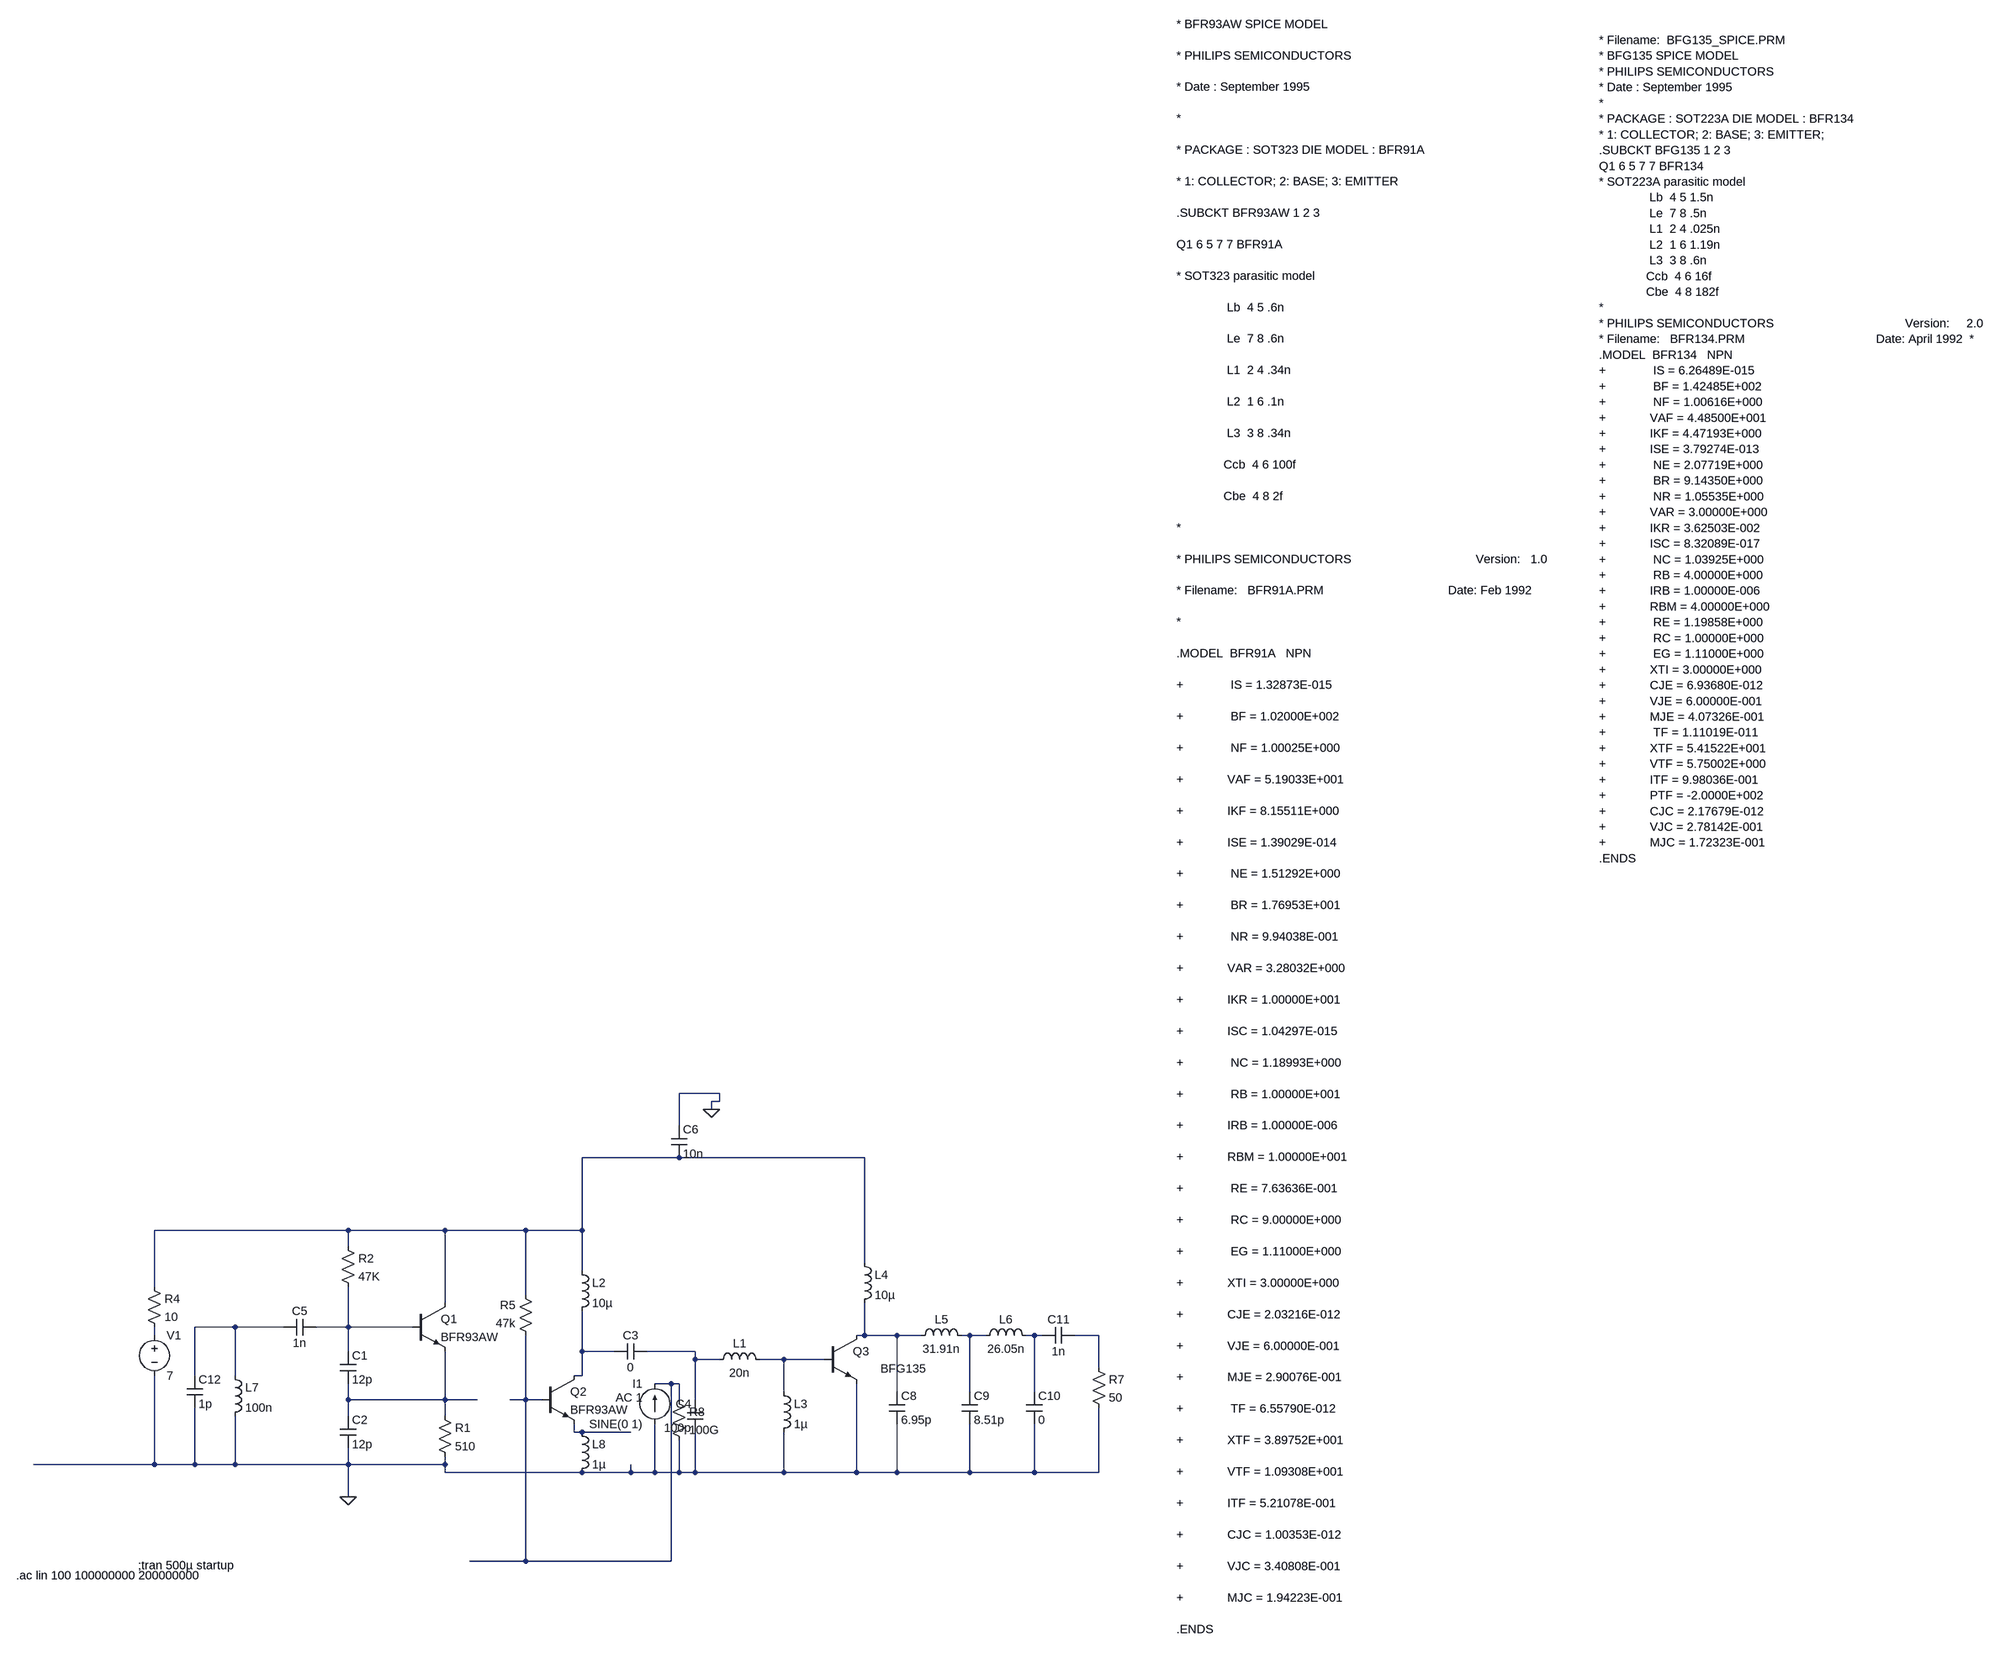
[diagram p0: schematic tx1.asc]
tx1.asc, the LTspice schematic file:
Version 4
SHEET 1 4656 820
WIRE 976 -960 896 -960
WIRE 976 -944 976 -960
WIRE 976 -944 960 -944
WIRE 960 -928 960 -944
WIRE 896 -896 896 -960
WIRE 896 -832 704 -832
WIRE 1264 -832 896 -832
WIRE 240 -688 -144 -688
WIRE 432 -688 240 -688
WIRE 592 -688 432 -688
WIRE 704 -688 704 -832
WIRE 704 -688 592 -688
WIRE 240 -656 240 -688
WIRE 1264 -624 1264 -832
WIRE 704 -608 704 -688
WIRE -144 -576 -144 -688
WIRE 592 -560 592 -688
WIRE 432 -544 432 -688
WIRE 16 -496 -64 -496
WIRE 112 -496 16 -496
WIRE 240 -496 240 -576
WIRE 240 -496 176 -496
WIRE 368 -496 240 -496
WIRE -144 -480 -144 -496
WIRE 1264 -480 1264 -544
WIRE 1264 -480 1248 -480
WIRE 1328 -480 1264 -480
WIRE 1376 -480 1328 -480
WIRE 1472 -480 1456 -480
WIRE 1504 -480 1472 -480
WIRE 1600 -480 1584 -480
WIRE 1616 -480 1600 -480
WIRE 1728 -480 1680 -480
WIRE 240 -448 240 -496
WIRE 704 -448 704 -528
WIRE 768 -448 704 -448
WIRE 928 -448 832 -448
WIRE 928 -432 928 -448
WIRE 976 -432 928 -432
WIRE 1104 -432 1056 -432
WIRE 1184 -432 1104 -432
WIRE 1728 -416 1728 -480
WIRE -64 -400 -64 -496
WIRE 16 -400 16 -496
WIRE 704 -400 704 -448
WIRE 704 -400 688 -400
WIRE 880 -384 848 -384
WIRE 896 -384 880 -384
WIRE 1104 -368 1104 -432
WIRE 1328 -368 1328 -480
WIRE 1472 -368 1472 -480
WIRE 1600 -368 1600 -480
WIRE 240 -352 240 -384
WIRE 432 -352 432 -448
WIRE 432 -352 240 -352
WIRE 496 -352 432 -352
WIRE 592 -352 592 -480
WIRE 592 -352 560 -352
WIRE 624 -352 592 -352
WIRE 896 -352 896 -384
WIRE 928 -352 928 -432
WIRE 240 -320 240 -352
WIRE 432 -320 432 -352
WIRE 688 -288 688 -304
WIRE 704 -288 688 -288
WIRE 800 -288 704 -288
WIRE -144 -224 -144 -400
WIRE -144 -224 -384 -224
WIRE -64 -224 -64 -336
WIRE -64 -224 -144 -224
WIRE 16 -224 16 -320
WIRE 16 -224 -64 -224
WIRE 240 -224 240 -256
WIRE 240 -224 16 -224
WIRE 432 -224 432 -240
WIRE 432 -224 240 -224
WIRE 432 -208 432 -224
WIRE 704 -208 432 -208
WIRE 800 -208 800 -224
WIRE 800 -208 704 -208
WIRE 848 -208 848 -304
WIRE 848 -208 800 -208
WIRE 896 -208 896 -272
WIRE 896 -208 848 -208
WIRE 928 -208 928 -288
WIRE 928 -208 896 -208
WIRE 1104 -208 1104 -288
WIRE 1104 -208 928 -208
WIRE 1248 -208 1248 -384
WIRE 1248 -208 1104 -208
WIRE 1328 -208 1328 -304
WIRE 1328 -208 1248 -208
WIRE 1472 -208 1472 -304
WIRE 1472 -208 1328 -208
WIRE 1600 -208 1600 -304
WIRE 1600 -208 1472 -208
WIRE 1728 -208 1728 -336
WIRE 1728 -208 1600 -208
WIRE 240 -160 240 -224
WIRE 592 -32 592 -352
WIRE 592 -32 480 -32
WIRE 880 -32 880 -384
WIRE 880 -32 592 -32
FLAG 240 -160 0
FLAG 960 -928 0
SYMBOL npn 368 -544 R0
SYMATTR InstName Q1
SYMATTR Value BFR93AW
SYMATTR Prefix X
SYMBOL res 416 -336 R0
SYMATTR InstName R1
SYMATTR Value 510
SYMBOL res 224 -672 R0
SYMATTR InstName R2
SYMATTR Value 47K
SYMBOL cap 224 -448 R0
SYMATTR InstName C1
SYMATTR Value 12p
SYMBOL cap 224 -320 R0
SYMATTR InstName C2
SYMATTR Value 12p
SYMBOL voltage -144 -496 R0
WINDOW 123 0 0 Left 2
WINDOW 39 0 0 Left 2
SYMATTR InstName V1
SYMATTR Value 7
SYMBOL res -160 -592 R0
SYMATTR InstName R4
SYMATTR Value 10
SYMBOL npn 624 -400 R0
SYMATTR InstName Q2
SYMATTR Value BFR93AW
SYMATTR Prefix X
SYMBOL res 608 -464 R180
WINDOW 0 36 76 Left 2
WINDOW 3 36 40 Left 2
SYMATTR InstName R5
SYMATTR Value 47k
SYMBOL ind 688 -624 R0
SYMATTR InstName L2
SYMATTR Value 10µ
SYMBOL npn 1184 -480 R0
WINDOW 3 111 66 Left 2
SYMATTR Value BFG135
SYMATTR InstName Q3
SYMATTR Prefix X
SYMBOL cap 832 -464 R90
WINDOW 0 0 32 VBottom 2
WINDOW 3 32 32 VTop 2
SYMATTR InstName C3
SYMATTR Value 0
SYMBOL cap 944 -288 R180
WINDOW 0 24 56 Left 2
WINDOW 3 24 8 Left 2
SYMATTR InstName C4
SYMATTR Value 100p
SYMBOL ind 960 -416 R270
WINDOW 0 32 56 VTop 2
WINDOW 3 5 56 VBottom 2
SYMATTR InstName L1
SYMATTR Value 20n
SYMBOL ind 1088 -384 R0
SYMATTR InstName L3
SYMATTR Value 1µ
SYMBOL ind 1248 -640 R0
SYMATTR InstName L4
SYMATTR Value 10µ
SYMBOL ind 1360 -464 R270
WINDOW 0 32 56 VTop 2
WINDOW 3 5 56 VBottom 2
SYMATTR InstName L5
SYMATTR Value 31.91n
SYMBOL ind 1488 -464 R270
WINDOW 0 32 56 VTop 2
WINDOW 3 5 56 VBottom 2
SYMATTR InstName L6
SYMATTR Value 26.05n
SYMBOL cap 1312 -368 R0
SYMATTR InstName C8
SYMATTR Value 6.95p
SYMBOL cap 1456 -368 R0
SYMATTR InstName C9
SYMATTR Value 8.51p
SYMBOL cap 1584 -368 R0
SYMATTR InstName C10
SYMATTR Value 0
SYMBOL cap 1680 -496 R90
WINDOW 0 0 32 VBottom 2
WINDOW 3 32 32 VTop 2
SYMATTR InstName C11
SYMATTR Value 1n
SYMBOL res 1712 -432 R0
SYMATTR InstName R7
SYMATTR Value 50
SYMBOL current 848 -304 R180
WINDOW 0 24 80 Left 2
WINDOW 3 24 0 Left 2
WINDOW 123 24 52 Left 2
WINDOW 39 0 0 Left 2
SYMATTR InstName I1
SYMATTR Value SINE(0 1)
SYMATTR Value2 AC 1
SYMBOL res 880 -368 R0
SYMATTR InstName R8
SYMATTR Value 100G
SYMBOL ind 0 -416 R0
SYMATTR InstName L7
SYMATTR Value 100n
SYMBOL cap -80 -400 R0
SYMATTR InstName C12
SYMATTR Value 1p
SYMBOL cap 176 -512 R90
WINDOW 0 0 32 VBottom 2
WINDOW 3 32 32 VTop 2
SYMATTR InstName C5
SYMATTR Value 1n
SYMBOL cap 880 -896 R0
SYMATTR InstName C6
SYMATTR Value 10n
SYMBOL ind 688 -304 R0
SYMATTR InstName L8
SYMATTR Value 1µ
TEXT 2624 -3080 Left 2 !* BFR93AW SPICE MODEL\n\n* PHILIPS SEMICONDUCTORS\n\n* Date : September 1995\n\n*\n\n* PACKAGE : SOT323 DIE MODEL : BFR91A\n\n* 1: COLLECTOR; 2: BASE; 3: EMITTER\n\n.SUBCKT BFR93AW 1 2 3\n\nQ1 6 5 7 7 BFR91A\n\n* SOT323 parasitic model\n\n               Lb  4 5 .6n \n\n               Le  7 8 .6n\n\n               L1  2 4 .34n\n\n               L2  1 6 .1n\n\n               L3  3 8 .34n\n\n              Ccb  4 6 100f\n\n              Cbe  4 8 2f\n\n*\n\n* PHILIPS SEMICONDUCTORS                                     Version:   1.0\n\n* Filename:   BFR91A.PRM                                     Date: Feb 1992\n\n*\n\n.MODEL  BFR91A   NPN\n\n+              IS = 1.32873E-015\n\n+              BF = 1.02000E+002\n\n+              NF = 1.00025E+000\n\n+             VAF = 5.19033E+001\n\n+             IKF = 8.15511E+000\n\n+             ISE = 1.39029E-014\n\n+              NE = 1.51292E+000\n\n+              BR = 1.76953E+001\n\n+              NR = 9.94038E-001\n\n+             VAR = 3.28032E+000\n\n+             IKR = 1.00000E+001\n\n+             ISC = 1.04297E-015\n\n+              NC = 1.18993E+000\n\n+              RB = 1.00000E+001\n\n+             IRB = 1.00000E-006\n\n+             RBM = 1.00000E+001\n\n+              RE = 7.63636E-001\n\n+              RC = 9.00000E+000\n\n+              EG = 1.11000E+000\n\n+             XTI = 3.00000E+000\n\n+             CJE = 2.03216E-012\n\n+             VJE = 6.00000E-001\n\n+             MJE = 2.90076E-001\n\n+              TF = 6.55790E-012\n\n+             XTF = 3.89752E+001\n\n+             VTF = 1.09308E+001\n\n+             ITF = 5.21078E-001\n\n+             CJC = 1.00353E-012\n\n+             VJC = 3.40808E-001\n\n+             MJC = 1.94223E-001\n\n.ENDS
TEXT -176 -24 Left 2 !;tran 500µ startup
TEXT 3776 -3048 Left 2 !* Filename:  BFG135_SPICE.PRM\n* BFG135 SPICE MODEL\n* PHILIPS SEMICONDUCTORS\n* Date : September 1995\n*\n* PACKAGE : SOT223A DIE MODEL : BFR134\n* 1: COLLECTOR; 2: BASE; 3: EMITTER;\n.SUBCKT BFG135 1 2 3\nQ1 6 5 7 7 BFR134\n* SOT223A parasitic model\n               Lb  4 5 1.5n \n               Le  7 8 .5n\n               L1  2 4 .025n\n               L2  1 6 1.19n\n               L3  3 8 .6n\n              Ccb  4 6 16f\n              Cbe  4 8 182f\n*\n* PHILIPS SEMICONDUCTORS                                       Version:     2.0\n* Filename:   BFR134.PRM                                       Date: April 1992  *\n.MODEL  BFR134   NPN\n+              IS = 6.26489E-015\n+              BF = 1.42485E+002\n+              NF = 1.00616E+000\n+             VAF = 4.48500E+001\n+             IKF = 4.47193E+000\n+             ISE = 3.79274E-013\n+              NE = 2.07719E+000\n+              BR = 9.14350E+000\n+              NR = 1.05535E+000\n+             VAR = 3.00000E+000\n+             IKR = 3.62503E-002\n+             ISC = 8.32089E-017\n+              NC = 1.03925E+000\n+              RB = 4.00000E+000\n+             IRB = 1.00000E-006\n+             RBM = 4.00000E+000\n+              RE = 1.19858E+000\n+              RC = 1.00000E+000\n+              EG = 1.11000E+000\n+             XTI = 3.00000E+000\n+             CJE = 6.93680E-012\n+             VJE = 6.00000E-001\n+             MJE = 4.07326E-001\n+              TF = 1.11019E-011\n+             XTF = 5.41522E+001\n+             VTF = 5.75002E+000\n+             ITF = 9.98036E-001\n+             PTF = -2.0000E+002\n+             CJC = 2.17679E-012\n+             VJC = 2.78142E-001\n+             MJC = 1.72323E-001\n.ENDS
TEXT -418 -4 Left 2 !.ac lin 100 100000000 200000000

The netlist it stands for:
* tx1.asc
XQ1 N001 N003 N013 BFR93AW  ; pins C B E
R1 N013 0 510
R2 N001 N003 47K
C1 N003 N013 12p
C2 N013 0 12p
V1 N004 0 7
R4 N001 N004 10
XQ2 N009 N012 N014 BFR93AW  ; pins C B E
R5 N012 N001 47k
L2 N001 N009 10µ
XQ3 N005 N011 0 BFG135  ; pins C B E
C3 N010 N009 0
C4 0 N010 100p
L1 N010 N011 20n
L3 N011 0 1µ
L4 N001 N005 10µ
L5 N005 N006 31.91n
L6 N006 N007 26.05n
C8 N005 0 6.95p
C9 N006 0 8.51p
C10 N007 0 0
C11 N008 N007 1n
R7 N008 0 50
I1 0 N012 SINE(0 1) AC 1
R8 N012 0 100G
L7 N002 0 100n
C12 N002 0 1p
C5 N003 N002 1n
C6 0 N001 10n
L8 N014 0 1µ
* BFR93AW SPICE MODEL
* PHILIPS SEMICONDUCTORS
* Date : September 1995
*
* PACKAGE : SOT323 DIE MODEL : BFR91A
* 1: COLLECTOR; 2: BASE; 3: EMITTER
.SUBCKT BFR93AW 1 2 3
Q1 6 5 7 7 BFR91A
* SOT323 parasitic model
               Lb  4 5 .6n
               Le  7 8 .6n
               L1  2 4 .34n
               L2  1 6 .1n
               L3  3 8 .34n
              Ccb  4 6 100f
              Cbe  4 8 2f
*
* PHILIPS SEMICONDUCTORS                                     Version:   1.0
* Filename:   BFR91A.PRM                                     Date: Feb 1992
*
.MODEL  BFR91A   NPN
+              IS = 1.32873E-015
+              BF = 1.02000E+002
+              NF = 1.00025E+000
+             VAF = 5.19033E+001
+             IKF = 8.15511E+000
+             ISE = 1.39029E-014
+              NE = 1.51292E+000
+              BR = 1.76953E+001
+              NR = 9.94038E-001
+             VAR = 3.28032E+000
+             IKR = 1.00000E+001
+             ISC = 1.04297E-015
+              NC = 1.18993E+000
+              RB = 1.00000E+001
+             IRB = 1.00000E-006
+             RBM = 1.00000E+001
+              RE = 7.63636E-001
+              RC = 9.00000E+000
+              EG = 1.11000E+000
+             XTI = 3.00000E+000
+             CJE = 2.03216E-012
+             VJE = 6.00000E-001
+             MJE = 2.90076E-001
+              TF = 6.55790E-012
+             XTF = 3.89752E+001
+             VTF = 1.09308E+001
+             ITF = 5.21078E-001
+             CJC = 1.00353E-012
+             VJC = 3.40808E-001
+             MJC = 1.94223E-001
.ENDS
;tran 500µ startup
* Filename:  BFG135_SPICE.PRM
* BFG135 SPICE MODEL
* PHILIPS SEMICONDUCTORS
* Date : September 1995
*
* PACKAGE : SOT223A DIE MODEL : BFR134
* 1: COLLECTOR; 2: BASE; 3: EMITTER;
.SUBCKT BFG135 1 2 3
Q1 6 5 7 7 BFR134
* SOT223A parasitic model
               Lb  4 5 1.5n
               Le  7 8 .5n
               L1  2 4 .025n
               L2  1 6 1.19n
               L3  3 8 .6n
              Ccb  4 6 16f
              Cbe  4 8 182f
*
* PHILIPS SEMICONDUCTORS                                       Version:     2.0
* Filename:   BFR134.PRM                                       Date: April 1992  *
.MODEL  BFR134   NPN
+              IS = 6.26489E-015
+              BF = 1.42485E+002
+              NF = 1.00616E+000
+             VAF = 4.48500E+001
+             IKF = 4.47193E+000
+             ISE = 3.79274E-013
+              NE = 2.07719E+000
+              BR = 9.14350E+000
+              NR = 1.05535E+000
+             VAR = 3.00000E+000
+             IKR = 3.62503E-002
+             ISC = 8.32089E-017
+              NC = 1.03925E+000
+              RB = 4.00000E+000
+             IRB = 1.00000E-006
+             RBM = 4.00000E+000
+              RE = 1.19858E+000
+              RC = 1.00000E+000
+              EG = 1.11000E+000
+             XTI = 3.00000E+000
+             CJE = 6.93680E-012
+             VJE = 6.00000E-001
+             MJE = 4.07326E-001
+              TF = 1.11019E-011
+             XTF = 5.41522E+001
+             VTF = 5.75002E+000
+             ITF = 9.98036E-001
+             PTF = -2.0000E+002
+             CJC = 2.17679E-012
+             VJC = 2.78142E-001
+             MJC = 1.72323E-001
.ENDS
.ac lin 100 100000000 200000000
.backanno
.end